# EAGLE design RATT_REV0 (EAGLE 7.7.0)
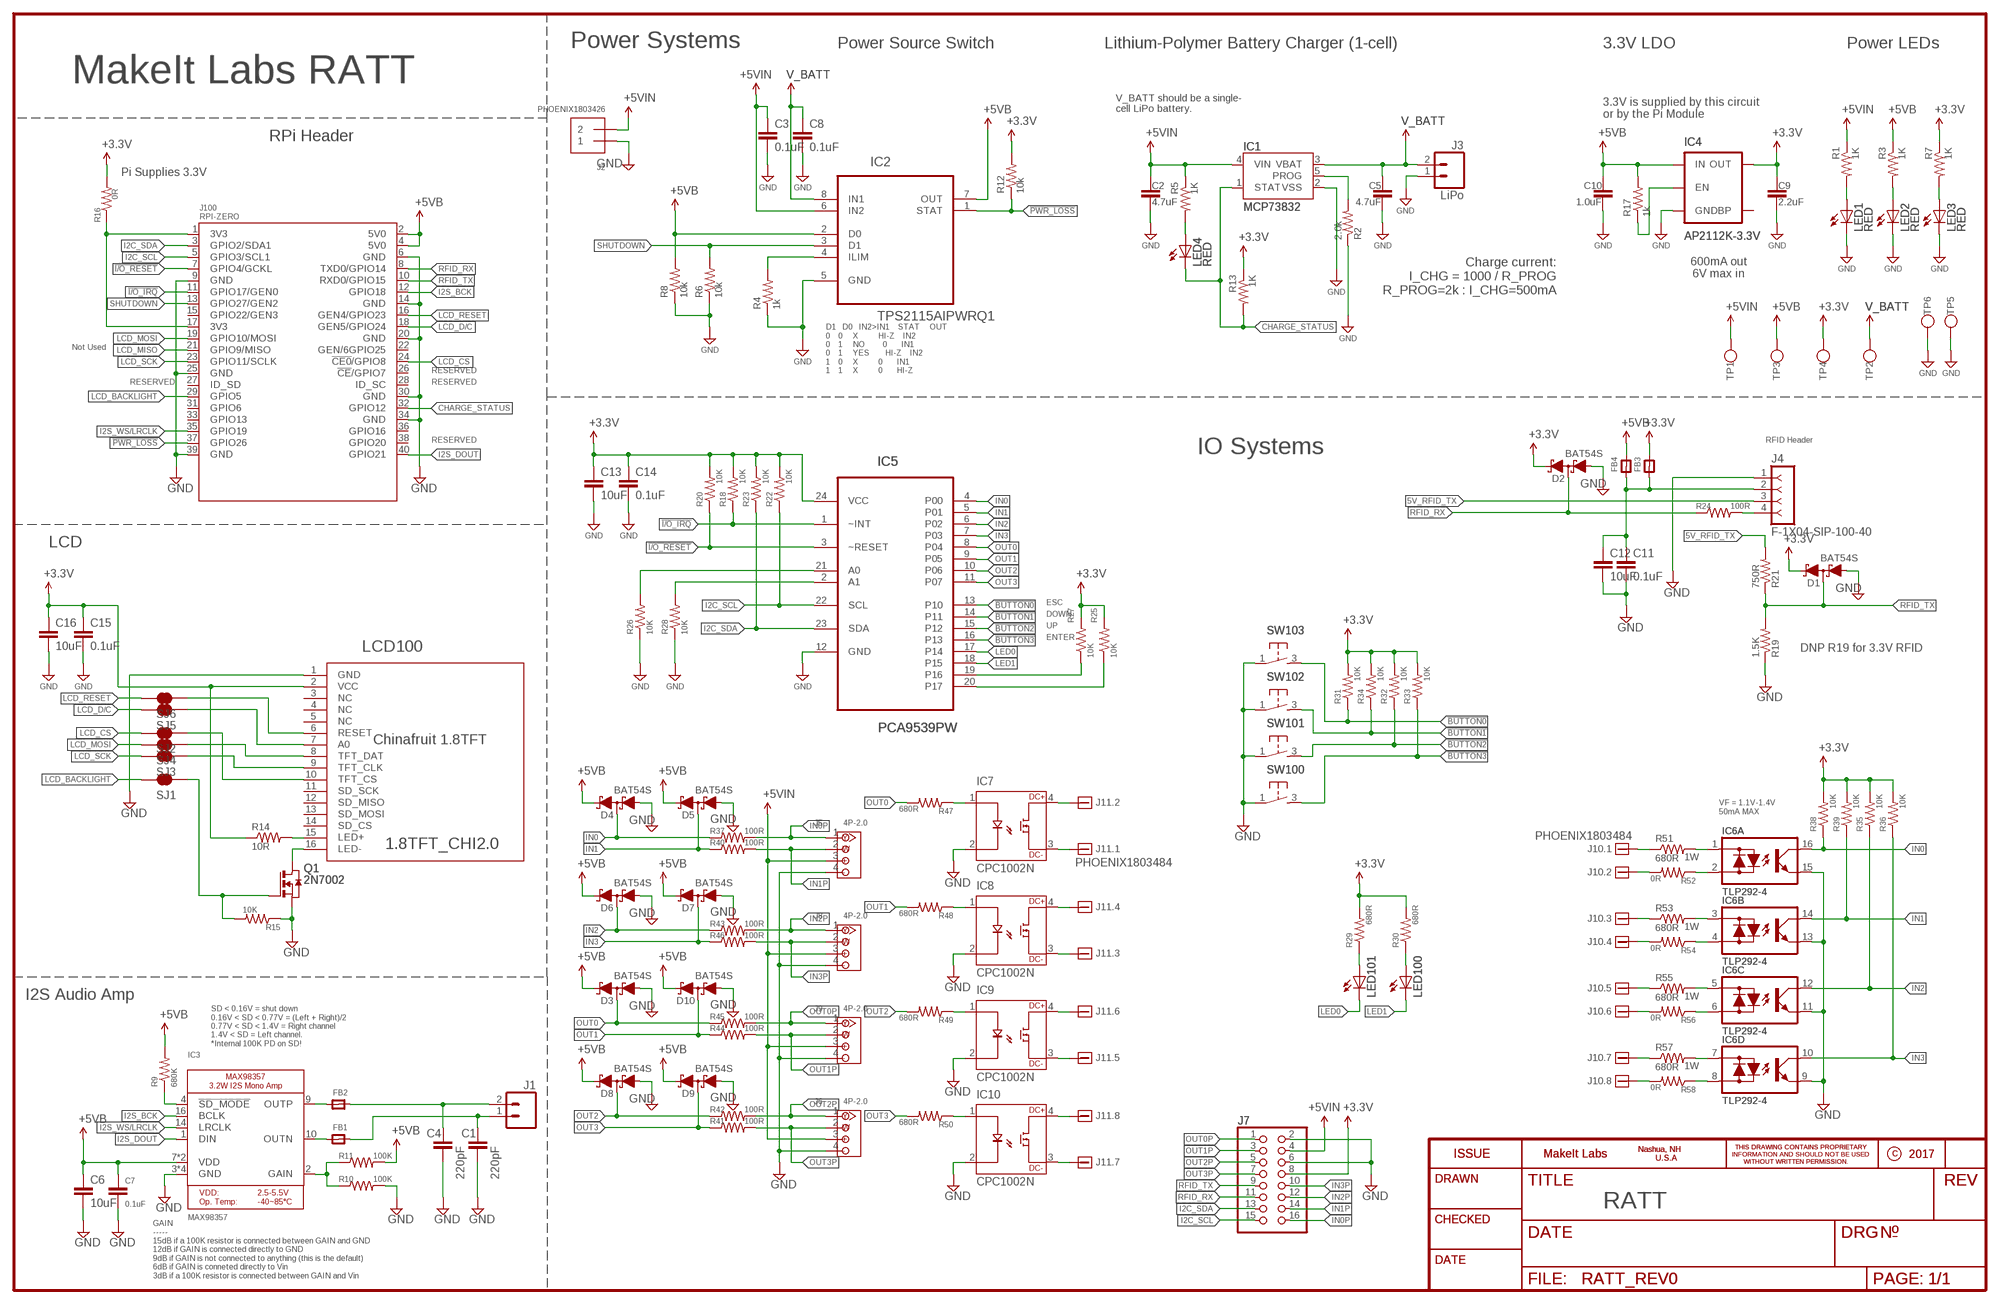
[diagram p0: schematic, sheet 1]

## Parts
C1  220pF  CAP0603  [0603-CAP]
C2  4.7uF  CAP0603  [0603-CAP]
C3  0.1uF  CAP0603  [0603-CAP]
C4  220pF  CAP0603  [0603-CAP]
C5  4.7uF  CAP0603  [0603-CAP]
C6  10uF  CAP0805  [0805-CAP]
C7  0.1uF  CAP0603  [0603-CAP]
C8  0.1uF  CAP0603  [0603-CAP]
C9  2.2uF  CAP0603  [0603-CAP]
C10  1.0uF  CAP0603  [0603-CAP]
C11  0.1uF  CAP0603  [0603-CAP]
C12  10uF  CAP0805  [0805-CAP]
C13  10uF  CAP0805  [0805-CAP]
C14  0.1uF  CAP0603  [0603-CAP]
C15  0.1uF  CAP0603  [0603-CAP]
C16  10uF  CAP0805  [0805-CAP]
D1  BAT54S  [SOT-23]
D2  BAT54S  [SOT-23]
D3  BAT54S  [SOT-23]
D4  BAT54S  [SOT-23]
D5  BAT54S  [SOT-23]
D6  BAT54S  [SOT-23]
D7  BAT54S  [SOT-23]
D8  BAT54S  [SOT-23]
D9  BAT54S  [SOT-23]
D10  BAT54S  [SOT-23]
FB1  FERRITE  [0603]
FB2  FERRITE  [0603]
FB3  FERRITE  [0603]
FB4  FERRITE  [0603]
IC1  MCP73832  MCP73831  [SOT23-5]
IC2  TPS2115AIPWRQ1  [SOP65P640X120-8N]
IC3  MAX98357  AUDIOAMP_MAX98357  [QFN16_3MM]
IC4  AP2112K-3.3V  V_REG_LDOSMD  [SOT23-5]
IC5  PCA9539PW  [SOP65P640X120-24N]
IC6  TLP292-4  [SO-16]
IC7  CPC1002N  [CPC1002N]
IC8  CPC1002N  [CPC1002N]
IC9  CPC1002N  [CPC1002N]
IC10  CPC1002N  [CPC1002N]
J1  M02POLAR  [MOLEX-1X2]
J2  PHOENIX1803426  [1803426]
J3  LiPo  M02JST-PTH-2  [JST-2-PTH]
J4  F-1X04-SIP-100-40  [SIP-100-04-40]
J5  4P-2.0  GROVE-CONNECTOR-TH-VERT  [HW4-2.0]
J6  4P-2.0  GROVE-CONNECTOR-TH-VERT  [HW4-2.0]
J7  PINHD-2X8SHROUD  [2X08_SHROUD]
J8  4P-2.0  GROVE-CONNECTOR-TH-VERT  [HW4-2.0]
J9  4P-2.0  GROVE-CONNECTOR-TH-VERT  [HW4-2.0]
J10  PHOENIX1803484  [1803484]
J11  PHOENIX1803484  [1803484]
J100  RPI-ZERO  [RASPBERRYPI_BASTELSTUBE_V13_RASPI_BOARD_B+_FULL]
LCD100  1.8TFT_CHI2.0  [1.8TFT_CHI_2.0]
LED1  RED  LED-RED0603  [LED-0603]
LED2  RED  LED-RED0603  [LED-0603]
LED3  RED  LED-RED0603  [LED-0603]
LED4  RED  LED-RED0603  [LED-0603]
LED100  LED5MM  [LED5MM]
LED101  LED5MM  [LED5MM]
Q1  2N7002  NMOSSOT23  [SOT-23]
R1  1K  RESISTOR0603  [0603-RES]
R2  2.0k  RESISTOR0603  [0603-RES]
R3  1K  RESISTOR0603  [0603-RES]
R4  1k  RESISTOR0603  [0603-RES]
R5  1K  RESISTOR0603  [0603-RES]
R6  10k  RESISTOR0603  [0603-RES]
R7  1K  RESISTOR0603  [0603-RES]
R8  10k  RESISTOR0603  [0603-RES]
R9  680K  RESISTOR0603  [0603-RES]
R10  100K  RESISTOR0603  [0603-RES]
R11  100K  RESISTOR0603  [0603-RES]
R12  10k  RESISTOR0603  [0603-RES]
R13  1K  RESISTOR0603  [0603-RES]
R14  10R  RESISTOR1206  [1206-RES]
R15  10K  RESISTOR0603  [0603-RES]
R16  0R  RESISTOR0603  [0603-RES]
R17  1k  RESISTOR0603  [0603-RES]
R18  10K  RESISTOR0603  [0603-RES]
R19  1.5K  RESISTOR0603  [0603-RES]
R20  10K  RESISTOR0603  [0603-RES]
R21  750R  RESISTOR0603  [0603-RES]
R22  10K  RESISTOR0603  [0603-RES]
R23  10K  RESISTOR0603  [0603-RES]
R24  100R  RESISTOR0603  [0603-RES]
R25  10K  RESISTOR0603  [0603-RES]
R26  10K  RESISTOR0603  [0603-RES]
R27  10K  RESISTOR0603  [0603-RES]
R28  10K  RESISTOR0603  [0603-RES]
R29  680R  RESISTOR0603  [0603-RES]
R30  680R  RESISTOR0603  [0603-RES]
R31  10K  RESISTOR0603  [0603-RES]
R32  10K  RESISTOR0603  [0603-RES]
R33  10K  RESISTOR0603  [0603-RES]
R34  10K  RESISTOR0603  [0603-RES]
R35  10K  RESISTOR0603  [0603-RES]
R36  10K  RESISTOR0603  [0603-RES]
R37  100R  RESISTOR0603  [0603-RES]
R38  10K  RESISTOR0603  [0603-RES]
R39  10K  RESISTOR0603  [0603-RES]
R40  100R  RESISTOR0603  [0603-RES]
R41  100R  RESISTOR0603  [0603-RES]
R42  100R  RESISTOR0603  [0603-RES]
R43  100R  RESISTOR0603  [0603-RES]
R44  100R  RESISTOR0603  [0603-RES]
R45  100R  RESISTOR0603  [0603-RES]
R46  100R  RESISTOR0603  [0603-RES]
R47  680R  RESISTOR0603  [0603-RES]
R48  680R  RESISTOR0603  [0603-RES]
R49  680R  RESISTOR0603  [0603-RES]
R50  680R  RESISTOR0603  [0603-RES]
R51  680R  RESISTOR2512  [2512-RES]
R52  0R  RESISTOR0603  [0603-RES]
R53  680R  RESISTOR2512  [2512-RES]
R54  0R  RESISTOR0603  [0603-RES]
R55  680R  RESISTOR2512  [2512-RES]
R56  0R  RESISTOR0603  [0603-RES]
R57  680R  RESISTOR2512  [2512-RES]
R58  0R  RESISTOR0603  [0603-RES]
SJ1  JUMPER-PAD-2-NC_BY_TRACE  SOLDERJUMPER_CLOSED10MIL  [SOLDERJUMPER_10MIL]
SJ2  JUMPER-PAD-2-NC_BY_TRACE  SOLDERJUMPER_CLOSED10MIL  [SOLDERJUMPER_10MIL]
SJ3  JUMPER-PAD-2-NC_BY_TRACE  SOLDERJUMPER_CLOSED10MIL  [SOLDERJUMPER_10MIL]
SJ4  JUMPER-PAD-2-NC_BY_TRACE  SOLDERJUMPER_CLOSED10MIL  [SOLDERJUMPER_10MIL]
SJ5  JUMPER-PAD-2-NC_BY_TRACE  SOLDERJUMPER_CLOSED10MIL  [SOLDERJUMPER_10MIL]
SJ6  JUMPER-PAD-2-NC_BY_TRACE  SOLDERJUMPER_CLOSED10MIL  [SOLDERJUMPER_10MIL]
SW100  ESWITCH_320  [ESWITCH320]
SW101  ESWITCH_320  [ESWITCH320]
SW102  ESWITCH_320  [ESWITCH320]
SW103  ESWITCH_320  [ESWITCH320]
TP1  5VIN  RCW-0C  [1206-RCW]
TP2  BATT  RCW-0C  [1206-RCW]
TP3  5VB  RCW-0C  [1206-RCW]
TP4  3.3V  RCW-0C  [1206-RCW]
TP5  GND  RCW-0C  [1206-RCW]
TP6  GND  RCW-0C  [1206-RCW]

## Nets
3V3: J100.1(3V3) J100.17(3V3) R16.1
5V_RFID_TX: J4.3 R21.2
!BUTTON0: IC5.13(P10) R31.1 SW103.3
!BUTTON1: IC5.14(P11) R34.1 SW102.3
!BUTTON2: IC5.15(P12) R32.1 SW101.3
!BUTTON3: IC5.16(P13) R33.1 SW100.3
!I/O_IRQ: IC5.1(~INT) J100.11(GPIO17/GEN0) R18.1
!I/O_RESET: IC5.3(~RESET) J100.7(GPIO4/GCKL) R20.1
!PWR_LOSS: IC2.1(STAT) J100.37(GPIO26) R12.1
+3.3V: C9.1 C13.1 C14.1 C15.1 C16.1 D1.2(C2) D2.2(C2) FB3.2 IC4.5(OUT) IC5.24(VCC) J7.8 LCD100.2(VCC) R7.1 R12.2 R13.1 R14.1 R16.2 R18.2 R20.2 R22.2 R23.2 R25.2 R27.2 R29.2 R30.2 R31.2 R32.2 R33.2 R34.2 R35.2 R36.2 R38.2 R39.2 TP4.1(TP)
+5VB: C6.1 C7.1 C10.1 D3.2(C2) D4.2(C2) D5.2(C2) D6.2(C2) D7.2(C2) D8.2(C2) D9.2(C2) D10.2(C2) FB4.2 IC2.2(D0) IC2.7(OUT) IC3.7(VDD) IC3.8(VDD) IC4.1(IN) J100.2(5V0) J100.4(5V0) R3.1 R8.2 R9.2 R11.2 R17.2 TP3.1(TP)
+5VIN: C2.1 C3.1 IC1.4(VIN) IC2.6(IN2) J2.2 J5.3 J6.3 J7.4 J8.3 J9.3 R1.1 R5.1 TP1.1(TP)
CHARGE_STATUS: IC1.1(STAT) J100.32(GPIO12) LED4.C R13.2
GND: C1.2 C2.2 C3.2 C4.2 C5.2 C6.2 C7.2 C8.2 C9.2 C10.2 C11.2 C12.2 C13.2 C14.2 C15.2 C16.2 D1.1(A1) D2.1(A1) D3.1(A1) D4.1(A1) D5.1(A1) D6.1(A1) D7.1(A1) D8.1(A1) D9.1(A1) D10.1(A1) IC1.2(VSS) IC2.5(GND) IC3.3(GND) IC3.11(GND) IC3.15(GND) IC3.THERMAL(GND) IC4.2(GND) IC5.12(GND) IC6.9(D:E) IC6.11(C:E) IC6.13(B:E) IC6.15(A:E) IC7.2(CATHODE) IC8.2(CATHODE) IC9.2(CATHODE) IC10.2(CATHODE) J2.1 J3.1 J4.1 J5.4 J6.4 J7.2 J7.6 J8.4 J9.4 J100.6(GND) J100.9(GND) J100.14(GND) J100.20(GND) J100.25(GND) J100.30(GND) J100.34(GND) J100.39(GND) LCD100.1(GND) LED1.C LED2.C LED3.C Q1.2(S) R2.1 R4.1 R6.1 R8.1 R10.2 R15.1 R19.1 R26.1 R28.1 SW100.1 SW101.1 SW102.1 SW103.1 TP5.1(TP) TP6.1(TP)
I2C_SCL: IC5.22(SCL) J7.15 J100.5(GPIO3/SCL1) R22.1
I2C_SDA: IC5.23(SDA) J7.13 J100.3(GPIO2/SDA1) R23.1
I2S_BCK: IC3.16(BCLK) J100.12(GPIO18)
I2S_DOUT: IC3.1(DIN) J100.40(GPIO21)
I2S_WS/LRCLK: IC3.14(LRCLK) J100.35(GPIO19)
IN0: D4.3(C1A2) IC5.4(P00) IC6.16(A:C) R37.1 R38.1
IN0P: J5.1 J7.16 R37.2
IN1: D5.3(C1A2) IC5.5(P01) IC6.14(B:C) R39.1 R40.1
IN1P: J5.2 J7.14 R40.2
IN2: D6.3(C1A2) IC5.6(P02) IC6.12(C:C) R35.1 R43.1
IN2P: J7.12 J8.1 R43.2
IN3: D7.3(C1A2) IC5.7(P03) IC6.10(D:C) R36.1 R46.1
IN3P: J7.10 J8.2 R46.2
LCD_BACKLIGHT: J100.29(GPIO5) SJ1.2
LCD_CS: J100.24(!CE0!/GPIO8) SJ2.2
LCD_D/C: J100.18(GEN5/GPIO24) SJ5.2
LCD_MISO: J100.21(GPIO9/MISO)
LCD_MOSI: J100.19(GPIO10/MOSI) SJ4.2
LCD_RESET: J100.16(GEN4/GPIO23) SJ6.2
LCD_SCK: J100.23(GPIO11/SCLK) SJ3.2
LED0: IC5.17(P14) LED101.K(C)
LED1: IC5.18(P15) LED100.K(C)
N$1: IC3.2(GAIN) R10.1 R11.1
N$2: FB2.1 IC3.9(OUTP)
N$4: FB1.1 IC3.10(OUTN)
N$5: IC3.4(!SD_MODE) R9.1
N$6: C1.1 FB1.2 J1.1
N$7: C4.1 FB2.2 J1.2
N$8: IC5.20(P17) R25.1
N$9: LCD100.15(LED+) R14.2
N$10: J4.4 R24.2
N$11: LED3.A R7.2
N$12: LED2.A R3.2
N$13: IC5.19(P16) R27.1
N$14: IC1.5(PROG) R2.2
N$15: IC6.2(A:AC2) R52.1
N$17: LED4.A R5.2
N$18: IC4.3(EN) R17.1
N$19: IC6.1(A:AC1) R51.2
N$20: IC6.8(D:AC2) R58.1
N$21: IC5.21(A0) R26.2
N$22: IC5.2(A1) R28.2
N$23: IC6.7(D:AC1) R57.2
N$24: IC6.6(C:AC2) R56.1
N$25: IC6.5(C:AC1) R55.2
N$27: LCD100.6(RESET) SJ6.1
N$28: LCD100.7(A0) SJ5.1
N$29: LCD100.10(TFT_CS) SJ2.1
N$30: LCD100.8(TFT_DAT) SJ4.1
N$31: LCD100.9(TFT_CLK) SJ3.1
N$32: IC7.3(DC-) J11.1
N$33: Q1.3(G) R15.2 SJ1.1
N$34: LCD100.16(LED-) Q1.1(D)
N$36: IC6.4(B:AC2) R54.1
N$37: IC2.4(ILIM) R4.2
N$39: IC6.3(B:AC1) R53.2
N$40: J10.4 R54.2
N$41: J10.3 R53.1
N$42: J10.2 R52.2
N$43: J10.1 R51.1
N$44: J10.5 R55.1
N$45: J10.6 R56.2
N$46: J10.7 R57.1
N$47: J10.8 R58.2
N$48: LED101.A R29.1
N$49: LED100.A R30.1
N$50: LED1.A R1.2
N$51: C11.1 C12.1 FB3.1 FB4.1 J4.2
N$58: IC7.1(ANODE) R47.1
N$59: IC7.4(DC+) J11.2
N$60: IC10.3(DC-) J11.7
N$61: IC8.1(ANODE) R48.1
N$62: IC10.4(DC+) J11.8
N$63: IC9.3(DC-) J11.5
N$64: IC9.4(DC+) J11.6
N$65: IC8.3(DC-) J11.3
N$66: IC8.4(DC+) J11.4
N$68: IC9.1(ANODE) R49.1
N$69: IC10.1(ANODE) R50.1
OUT0: D3.3(C1A2) IC5.8(P04) R45.1 R47.2
OUT0P: J7.1 J9.1 R45.2
OUT1: D10.3(C1A2) IC5.9(P05) R44.1 R48.2
OUT1P: J7.3 J9.2 R44.2
OUT2: D8.3(C1A2) IC5.10(P06) R42.1 R49.2
OUT2P: J6.1 J7.5 R42.2
OUT3: D9.3(C1A2) IC5.11(P07) R41.1 R50.2
OUT3P: J6.2 J7.7 R41.2
RFID_RX: D2.3(C1A2) J7.11 J100.8(TXD0/GPIO14) R24.1
RFID_TX: D1.3(C1A2) J7.9 J100.10(RXD0/GPIO15) R19.2 R21.1
SHUTDOWN: IC2.3(D1) J100.13(GPIO27/GEN2) R6.2
V_BATT: C5.1 C8.1 IC1.3(VBAT) IC2.8(IN1) J3.2 TP2.1(TP)
Unconnected: IC4.4(BP) J100.15(GPIO22/GEN3) J100.22(GEN/6GPIO25) J100.26(!CE!/GPIO7) J100.27(ID_SD) J100.28(ID_SC) J100.31(GPIO6) J100.33(GPIO13) J100.36(GPIO16) J100.38(GPIO20) LCD100.3(NC) LCD100.4(NC) LCD100.5(NC) LCD100.11(SD_SCK) LCD100.12(SD_MISO) LCD100.13(SD_MOSI) LCD100.14(SD_CS)

## Notes on the sheet
- Power Systems | Power Source Switch | Lithium-Polymer Battery Charger (1-cell) | 3.3V LDO | Power LEDs
- MakeIt Labs RATT
- V_BATT should be a single-
  cell LiPo battery.
- 3.3V is supplied by this circuit
  or by the Pi Module
- RPi Header
- Pi Supplies 3.3V
- Charge current:
  I_CHG = 1000 / R_PROG
  R_PROG=2k : I_CHG=500mA
- 600mA out
  6V max in
- Not Used
- RESERVED
- D1   D0   IN2>IN1    STAT     OUT
  0    0     X          HI-Z    IN2
  0    1     NO         0       IN1
  0    1     YES        HI-Z    IN2
  1    0     X          0       IN1
  1    1     X          0       HI-Z
- RESERVED | RESERVED
- RESERVED | RFID Header
- IO Systems
- LCD
- ESC
- DOWN
- UP
- ENTER
- DNP R19 for 3.3V RFID
- VF = 1.1V-1.4V
  50mA MAX
- I2S Audio Amp
- SD < 0.16V = shut down 
  0.16V < SD < 0.77V = (Left + Right)/2 
  0.77V < SD < 1.4V = Right channel
  1.4V < SD = Left channel.
  *Internal 100K PD on SD!
- RATT
- GAIN
  -----
  15dB if a 100K resistor is connected between GAIN and GND 
  12dB if GAIN is connected directly to GND 
  9dB if GAIN is not connected to anything (this is the default)
  6dB if GAIN is conneted directly to Vin 
  3dB if a 100K resistor is connected between GAIN and Vin

## Library data of the parts
C1-C6 C8-C16 = MakeItLabs:CAP: Capacitor Standard ceramic capacitor Footprints per IPC-7351 Density Level B
C7 = MakeItLabs:CAP: Capacitor Standard ceramic capacitor Footprints per IPC-7351 Density Level B; RATING: X7R; TOL: 10%; V: 16V
D1-D10 = MakeItLabs:BAT54S: Schottky Diodes Dual Diodes, Cathode to Anode
FB1-FB4 = MakeItLabs:FERRITE: Ferrite Bead 0603 MMZ1608B121C - 120 Ohm @ 100MHz, 600mA, 0.15 Ohm DC Resistance - Digikey: 445-2164-1-ND BK1608HW121-T - 120 Ohm, 600mA Ferrite Chip - Digikey: 587-1876-2-ND 0805 HZ0805B272R-10 - 2.7K Ohm @ 100MHz, 200mA, 0.8 Ohm DC Resistance - Digikey: 240-2504-1-ND (see also Murata BLM21BD272SN1L) MMZ2012Y152B - 1.5K Ohm @ 100MHz, 500mA, 0.4 Ohm DC Resistance - Digikey: 445-1560-1-ND - Mainly for high frequency (80-400MHz) MMZ2012R102A - 1K Ohm @ 100MHz, 500mA, 0.3 Ohm DC Resistance - Digikey: 445-1555-2-ND - More general purpose (10-200MHz)
IC1 = MakeItLabs:MCP73831: Miniature single cell, fully integrated Li-Ion, Li-polymer charge management controller http://ww1.microchip.com/downloads/en/DeviceDoc/20001984g.pdf IC-09995; PROD_ID: IC-09995
IC2 = MakeItLabs:TPS2115AIPWRQ1: AUTO-SWITCHING POWER MULTIPLEXER; MPN: TPS2115AIPWRQ1; OC_FARNELL: -; OC_NEWARK: 52P6807; PACKAGE: TSSOP-8; SUPPLIER: Texas Instruments
IC3 = MakeItLabs:AUDIOAMP_MAX98357: MAX98357 - 3.2W I2S Mono Audio Amp
IC4 = MakeItLabs:V_REG_LDO: Voltage Regulator LDO Standard 150mA LDO voltage regulator in SOT-23 layout. Micrel part MIC5205. BP (by-pass) pin is used to lower output noise with 470pF cap.; PROD_ID: VREG-12457
IC5 = MakeItLabs:PCA9539PW: REMOTE 16-BIT I2C AND SMBus LOW-POWER I/O EXPANDER WITH INTERRUPT OUTPUT, RESET, AND CONFIGURATION REGISTERS; MPN: PCA9539PW; OC_FARNELL: 1470505; OC_NEWARK: 63K6061; PACKAGE: TSSOP-24; SUPPLIER: Texas Instruments
IC6 = MakeItLabs:TLP292-4: Optoisolator Transistor Output 3750Vrms 4 Channel 16-SO
IC7-IC10 = MakeItLabs:CPC1002N
J1 J3 = MakeItLabs:M02: Header 2 Standard 2-pin 0.1" header. Use with straight break away headers (SKU : PRT-00116), right angle break away headers (PRT-00553), swiss pins (PRT-00743), machine pins (PRT-00117), and female headers (PRT-00115). Molex polarized connector foot print use with SKU : PRT-08233 with associated crimp pins and housings.
J2 = MakeItLabs:PHOENIX1803426
J4 = MakeItLabs:F-1X04-: FEMALE HEADER
J5 J6 J8 J9 = MakeItLabs:GROVE-CONNECTOR-TH: 320110033
J7 = MakeItLabs:PINHD-2X8: PIN HEADER
J10 J11 = MakeItLabs:PHOENIX1803484: 8 A 60 V Pitch: 3.81 mm Position: 8 Source: https://www.phoenixcontact.com/us/products/1803484
J100 = MakeItLabs:RPI-ZERO
LCD100 = MakeItLabs:1.8TFT_CHI
LED1-LED4 = MakeItLabs:LED-RED: Assorted Red LEDs LilyPad 1206- DIO-09912 1206- DIO-00809 0603- DIO-00819; PROD_ID: DIO-09912
LED100 LED101 = MakeItLabs:LED: LEDs Standard schematic elements and footprints for 5mm, 3mm, 1206, and 0603 sized LEDs. 5mm - Spark Fun Electronics SKU : COM-00529 (and others)
Q1 = MakeItLabs:NMOSSOT23: MOS FET; OC_FARNELL: unknown; OC_NEWARK: unknown
R1-R50 R52 R54 R56 R58 = MakeItLabs:RESISTOR: Resistor Basic schematic elements and footprints for 0603, 1206, and PTH resistors.
R51 R53 R55 R57 = MakeItLabs:RESISTOR: Resistor Basic schematic elements and footprints for 0603, 1206, and PTH resistors.; P: 1W
SJ1-SJ6 = MakeItLabs:SOLDERJUMPER_CLOSED: Solder Jumper - Closed These solder jumpers are closed by default CLOSEDWIRE - 10 mil trace between pads that can be cut and resoldered later CLOSEDPERM - 63 mil trace between pads for a permanent connection (used to 'bridge' two signals, a shameless hack for Eagle). Can double as a test point as well (no cream layer)
SW100-SW103 = MakeItLabs:ESWITCH_320
TP1-TP6 = MakeItLabs:RCW-0C: SMD Circuit Probe Pad Test Pad 1206 Size

## Board
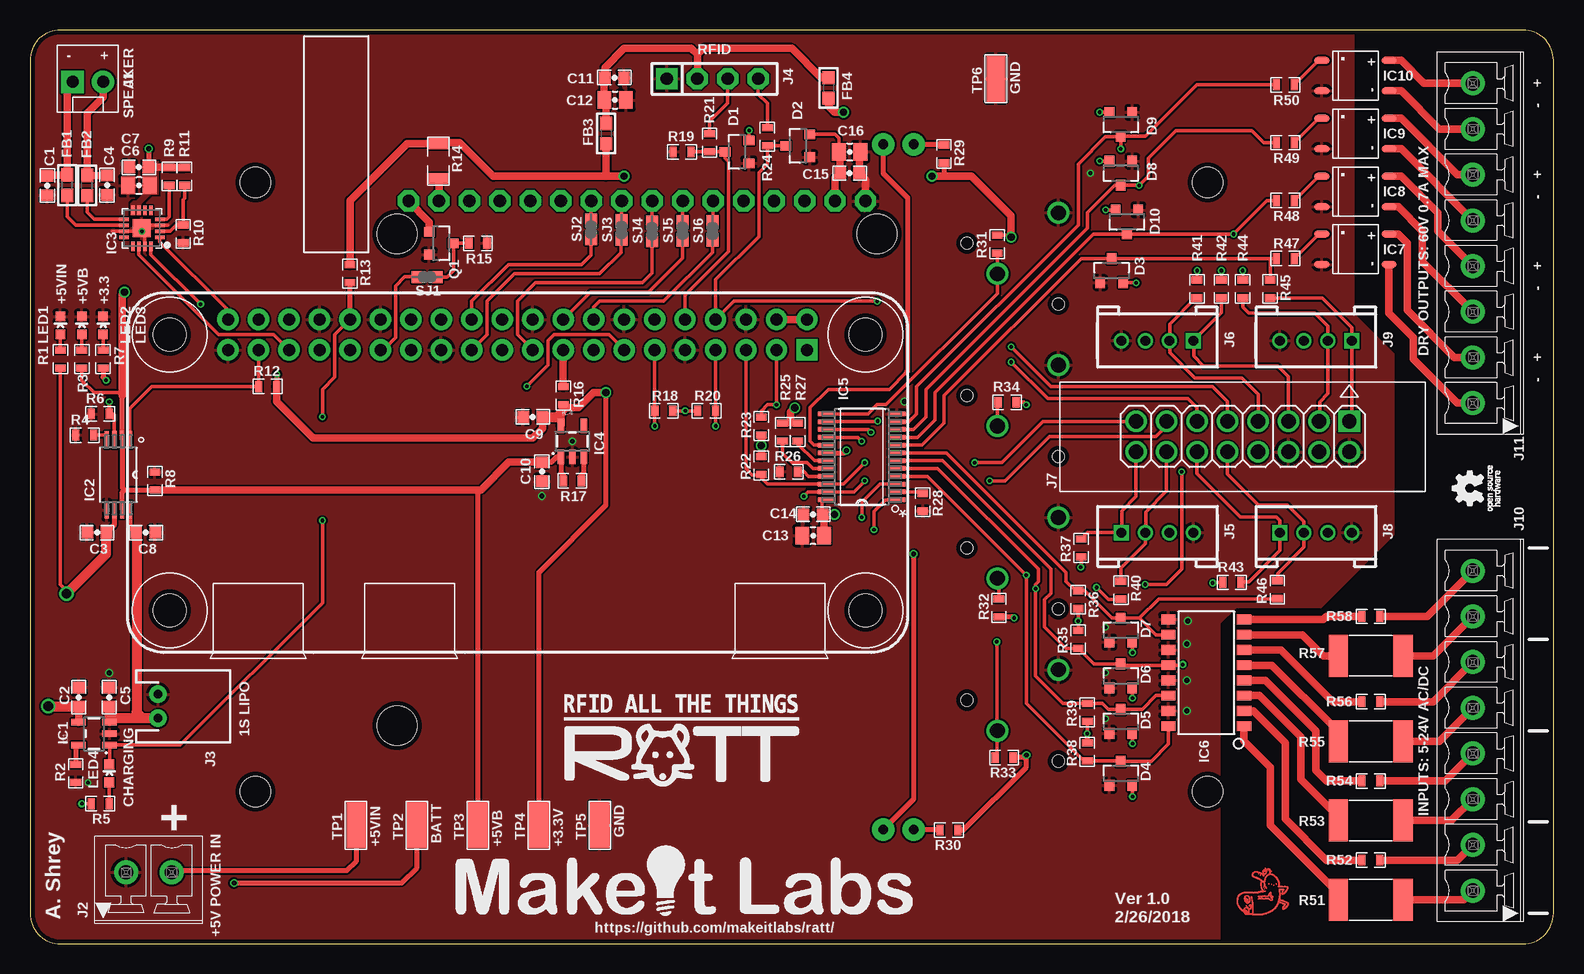
[diagram p1: board, top side]
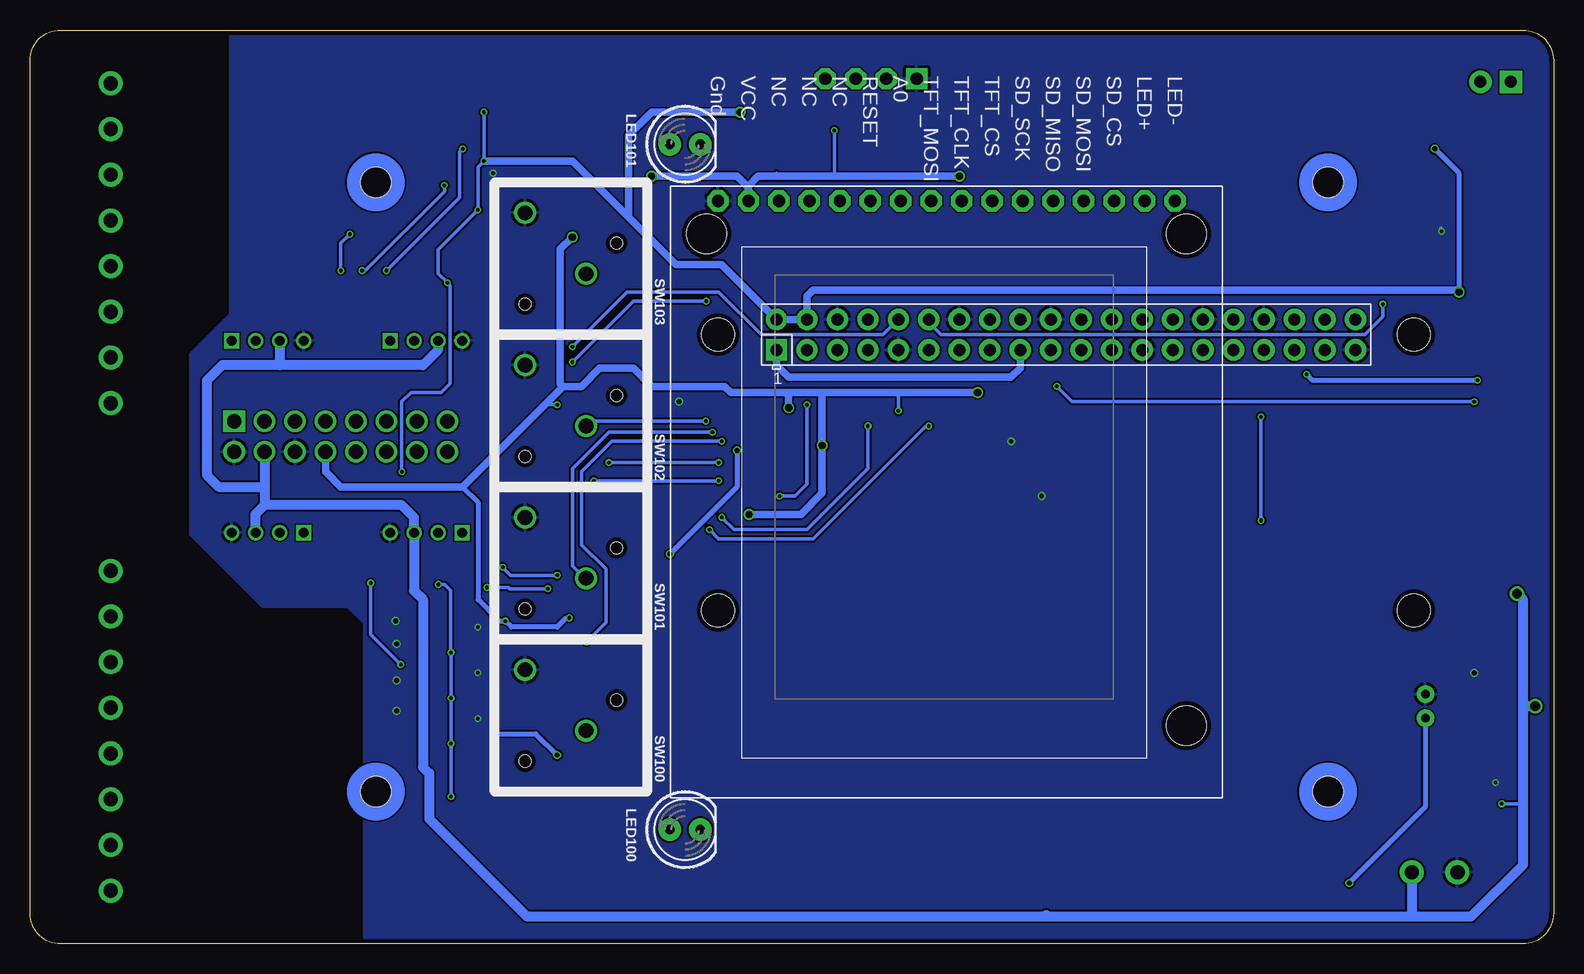
[diagram p2: board, bottom side, seen from below]

Size 127 x 76.2 mm. Coordinates in mm from the lower left corner, seen from the top.
Outline: 0,2.54 arc90 2.54,0 124.46,0 arc90 127,2.54 127,73.66 arc90 124.46,76.2 2.54,76.2 arc90 0,73.66 0,2.54
Copper layers (1*16): Top 0.035559375mm / dielectric 1.6mm / Bottom 0.035559375mm
Design rules "oshpark-2layer *": minimum track width 6mil, minimum drill 10mil, track to track 6mil, track to pad 6mil, pad to pad 6mil, via to via 6mil, smd to smd 6mil, copper to edge 15mil, drill to drill 6mil, minimum pad ring 5mil, minimum via ring 5mil, stop-mask expansion 2.5mil, vias tented up to drill 0mil, thermal gap 10mil
Holes 2.54 mm at 18.8,63.5 18.8,12.7 98.17,63.5 98.17,12.7
tKeepout: area 15,59.7 to 22.6,67.3; area 15,8.9 to 22.6,16.5; area 94.4,8.9 to 102,16.5; area 94.4,59.7 to 102,67.3

### Footprints (pad centres in the part's own frame; a part is rotated, then mirrored left to right if it is on the bottom)
0603-CAP = smd 0.95 x 1: 1 -0.8,0; 2 0.8,0
0805-CAP = smd 1.15 x 1.45: 1 -0.9,0; 2 0.9,0
SOT-23 = smd 0.8 x 0.9: 1 -0.95,-1; 2 0.95,-1; 3 0,1
0603 = smd 1.1 x 1: 1 -0.85,0; 2 0.85,0
SOT23-5 = smd 0.55 x 1.2: 1 -0.95,-1.3; 2 0,-1.3; 3 0.95,-1.3; 4 0.95,1.3; 5 -0.95,1.3
SOP65P640X120-8N = smd 1.473 x 0.356: 1 -2.921,0.965; 2 -2.921,0.33; 3 -2.921,-0.33; 4 -2.921,-0.965; 5 2.921,-0.965; 6 2.921,-0.33; 7 2.921,0.33; 8 2.921,0.965
QFN16_3MM = smd 0.8 x 0.28: 1 -1.5,0.75; 2 -1.5,0.25; 3 -1.5,-0.25; 4 -1.5,-0.75; 9 1.5,-0.75; 10 1.5,-0.25; 11 1.5,0.25; 12 1.5,0.75 | smd 0.28 x 0.8: 5 -0.75,-1.5; 6 -0.25,-1.5; 7 0.25,-1.5; 8 0.75,-1.5; 13 0.75,1.5; 14 0.25,1.5; 15 -0.25,1.5; 16 -0.75,1.5 | smd 1.5 x 1.5: THERMAL 0,0
SOP65P640X120-24N = smd 1.473 x 0.356: 1 -2.921,3.581; 2 -2.921,2.921; 3 -2.921,2.286; 4 -2.921,1.626; 5 -2.921,0.965; 6 -2.921,0.33; 7 -2.921,-0.33; 8 -2.921,-0.965; 9 -2.921,-1.626; 10 -2.921,-2.286; 11 -2.921,-2.921; 12 -2.921,-3.581; 13 2.921,-3.581; 14 2.921,-2.921; 15 2.921,-2.286; 16 2.921,-1.626; 17 2.921,-0.965; 18 2.921,-0.33; 19 2.921,0.33; 20 2.921,0.965; 21 2.921,1.626; 22 2.921,2.286; 23 2.921,2.921; 24 2.921,3.581
SO-16 = smd 0.8 x 1.2: 1 -4.445,-3.15; 2 -3.175,-3.15; 3 -1.905,-3.15; 4 -0.635,-3.15; 5 0.635,-3.15; 6 1.905,-3.15; 7 3.175,-3.15; 8 4.445,-3.15; 9 4.445,3.15; 10 3.175,3.15; 11 1.905,3.15; 12 0.635,3.15; 13 -0.635,3.15; 14 -1.905,3.15; 15 -3.175,3.15; 16 -4.445,3.15
CPC1002N = smd 0.6 x 1.3: 1 -1.27,-2.8; 2 1.27,-2.8; 3 1.27,2.8; 4 -1.27,2.8
MOLEX-1X2 = drill 1.016 pad 1.88 square: 1 0,0 | drill 1.016 pad 1.88: 2 2.54,0
1803426 = drill 1.2 pad 2: 1 -1.905,0.635; 2 1.905,0.635
JST-2-PTH = drill 0.7 pad 1.448: 1 -1,0; 2 1,0
SIP-100-04-40 = drill 1.016 pad 1.778 square: 1 -3.81,0 | drill 1.016 pad 1.778 octagon: 2 -1.27,0; 3 1.27,0; 4 3.81,0
HW4-2.0 = drill 0.8 pad 1.27 square: 1 -3,0 | drill 0.8 pad 1.27: 2 -1,0; 3 1,0; 4 3,0
2X08_SHROUD = drill 1.2 square: 1 -8.89,-1.27 | drill 1.2: 2 -8.89,1.27; 3 -6.35,-1.27; 4 -6.35,1.27; 5 -3.81,-1.27; 6 -3.81,1.27; 7 -1.27,-1.27; 8 -1.27,1.27; 9 1.27,-1.27; 10 1.27,1.27; 11 3.81,-1.27; 12 3.81,1.27; 13 6.35,-1.27; 14 6.35,1.27; 15 8.89,-1.27; 16 8.89,1.27
1803484 = drill 1.2 pad 2: 1 -13.335,0.635; 2 -9.525,0.635; 3 -5.715,0.635; 4 -1.905,0.635; 5 1.905,0.635; 6 5.715,0.635; 7 9.525,0.635; 8 13.335,0.635
RASPBERRYPI_BASTELSTUBE_V13_RASPI_BOARD_B+_FULL = drill 1 pad 1.778 square: 1 -24.13,-1.27 | drill 1 pad 1.778: 2 -24.13,1.27; 3 -21.59,-1.27; 4 -21.59,1.27; 5 -19.05,-1.27; 6 -19.05,1.27; 7 -16.51,-1.27; 8 -16.51,1.27; 9 -13.97,-1.27; 10 -13.97,1.27; 11 -11.43,-1.27; 12 -11.43,1.27; 13 -8.89,-1.27; 14 -8.89,1.27; 15 -6.35,-1.27; 16 -6.35,1.27; 17 -3.81,-1.27; 18 -3.81,1.27; 19 -1.27,-1.27; 20 -1.27,1.27; 21 1.27,-1.27; 22 1.27,1.27; 23 3.81,-1.27; 24 3.81,1.27; 25 6.35,-1.27; 26 6.35,1.27; 27 8.89,-1.27; 28 8.89,1.27; 29 11.43,-1.27; 30 11.43,1.27; 31 13.97,-1.27; 32 13.97,1.27; 33 16.51,-1.27; 34 16.51,1.27; 35 19.05,-1.27; 36 19.05,1.27; 37 21.59,-1.27; 38 21.59,1.27; 39 24.13,-1.27; 40 24.13,1.27 | hole 2.75: -29,-23; -29,0; 29,-23; 29,0
1.8TFT_CHI_2.0 = drill 1.016 pad 1.778 octagon: 1 -23.85,-18.85; 2 -23.85,-16.31; 3 -23.85,-13.77; 4 -23.85,-11.23; 5 -23.85,-8.69; 6 -23.85,-6.15; 7 -23.85,-3.61; 8 -23.85,-1.07; 9 -23.85,1.47; 10 -23.85,4.01; 11 -23.85,6.55; 12 -23.85,9.09; 13 -23.85,11.63; 14 -23.85,14.17; 15 -23.85,16.71; 16 -23.85,19.25 | hole 3.3: 19.9,20.2; -21.1,-19.8; -21.1,20.2
LED-0603 = smd 0.8 x 0.8: A 0,-0.75; C 0,0.75
LED5MM = drill 0.813 pad 1.88: A -1.27,0; K 1.27,0
0603-RES = smd 0.6 x 0.9: 1 -0.75,0; 2 0.75,0
1206-RES = smd 0.9 x 1.6: 1 -1.45,0; 2 1.45,0
2512-RES = smd 1.6 x 3.5: 1 -2.7,0; 2 2.7,0
SOLDERJUMPER_10MIL = smd 1.1 x 1: 1 -0.762,0; 2 0.762,0 | smd 0.635 x 0.254: WIRE 0,0
ESWITCH320 = drill 1.22: 1 -3.81,3.81; 3 1.27,-1.27 | hole 1: -3.81,-3.81; 3.81,1.27
1206-RCW = smd 3.8 x 1.6: 1 0,0

### Placement (x,y rotation side)
C1  1.46,63.23 270 top
C2  4.06,20.57 90 top
C3  5.59,34.29 180 top
C4  6.42,63.26 270 top
C5  6.6,20.57 90 top
C6  9.08,63.23 180 top
C7  9.08,64.75 180 top
C8  9.65,34.29 0 top
C9  41.91,43.94 180 top
C10  42.67,39.37 270 top
C11  48.72,72.24 0 top
C12  48.77,70.36 0 top
C13  65.28,34.04 180 top
C14  65.28,35.81 180 top
C15  68.33,64.26 0 top
C16  68.33,66.04 0 top
D1  58.93,66.04 90 top
D2  64.01,66.55 90 top
D3  90.17,56.13 0 top
D4  90.93,14.22 0 top
D5  90.93,18.54 0 top
D6  90.93,22.35 0 top
D7  90.93,26.16 0 top
D8  90.93,64.26 180 top
D9  90.93,68.33 180 top
D10  91.44,60.2 180 top
FB1  3.12,63.26 90 top
FB2  4.76,63.23 90 top
FB3  48.01,67.56 270 top
FB4  66.55,71.37 270 top
IC1  5.33,17.53 90 top
IC2  7.37,39.12 270 top
IC3  9.33,59.67 180 top
IC4  45.21,41.91 0 top
IC5  69.34,40.61 180 top
IC6  98.04,22.61 90 top
IC7  110.49,57.91 270 top
IC8  110.49,62.74 270 top
IC9  110.49,67.56 270 top
IC10  110.49,72.39 270 top
J1  3.56,71.88 0 top
J2  9.91,5.33 0 top
J3  10.67,19.81 270 top
J4  56.9,72.14 0 top
J5  93.98,34.29 0 top
J6  93.98,50.29 180 top
J7  101.09,42.29 180 top
J8  107.19,34.29 0 top
J9  107.19,50.29 180 top
J10  120.9,17.78 90 top
J11  120.9,58.42 90 top
J100  40.64,50.8 0 bottom
LCD100  50.8,38.1 270 bottom
LED1  2.54,51.56 0 top
LED2  4.32,51.56 0 top
LED3  6.1,51.56 0 top
LED4  6.6,14.22 0 top
LED100  72.39,9.53 0 bottom
LED101  72.39,66.67 0 bottom
Q1  34.29,58.42 270 top
R1  2.54,48.77 90 top
R2  2K  [0603-RES]  3.81,14.22 90 top
R3  4.32,48.77 90 top
R4  270R  [0603-RES]  4.57,42.42 0 top
R5  5.84,11.68 0 top
R6  10K  [0603-RES]  5.84,44.2 0 top
R7  6.1,48.77 90 top
R8  10K  [0603-RES]  10.41,38.61 270 top
R9  11.62,63.99 90 top
R10  12.77,59.2 270 top
R11  12.89,63.99 90 top
R12  10K  [0603-RES]  19.81,46.48 0 top
R13  26.67,55.88 270 top
R14  34.04,65.28 270 top
R15  37.34,58.42 180 top
R16  44.45,45.72 270 top
R17  1K  [0603-RES]  45.21,38.61 180 top
R18  52.83,44.45 0 top
R19  2K  [0603-RES]  54.36,66.04 0 top
R20  56.39,44.45 180 top
R21  1K  [0603-RES]  56.64,66.8 90 top
R22  60.96,39.88 90 top
R23  60.96,43.18 270 top
R24  61.47,67.31 90 top
R25  62.74,42.67 90 top
R26  63.25,39.37 0 top
R27  64.01,42.67 90 top
R28  74.42,36.83 90 top
R29  76.19,65.86 270 top
R30  76.61,9.49 0 top
R31  80.62,58.34 90 top
R32  80.77,28.02 270 top
R33  81.2,15.54 0 top
R34  81.46,45.16 0 top
R35  87.38,25.4 90 top
R36  87.38,28.7 270 top
R37  87.63,33.02 90 top
R38  88.14,16 90 top
R39  88.14,19.3 270 top
R40  90.94,29.49 90 top
R41  97.28,54.61 270 top
R42  99.31,54.61 270 top
R43  100.18,30.13 0 top
R44  101.09,54.61 270 top
R45  103.38,54.61 270 top
R46  103.98,29.53 90 top
R47  104.65,57.15 180 top
R48  104.65,61.98 180 top
R49  104.65,66.8 180 top
R50  104.65,71.63 180 top
R51  111.76,3.68 180 top
R52  111.76,6.99 0 top
R53  111.76,10.29 180 top
R54  111.76,13.59 0 top
R55  111.76,16.89 180 top
R56  111.76,20.19 0 top
R57  111.76,24.03 180 top
R58  111.76,27.3 0 top
SJ1  33.1,55.6 180 top
SJ2  46.77,59.57 270 top
SJ3  49.31,59.52 270 top
SJ4  51.85,59.42 270 top
SJ5  54.39,59.46 270 top
SJ6  56.9,59.44 270 top
SW100  81.92,19.05 0 bottom
SW101  81.92,31.75 0 bottom
SW102  81.92,44.45 0 bottom
SW103  81.92,57.15 0 bottom
TP1  27.18,9.91 90 top
TP2  32.26,9.91 90 top
TP3  37.34,9.91 90 top
TP4  42.42,9.91 90 top
TP5  47.5,9.91 90 top
TP6  80.52,72.14 90 top

### Tracks (layer width: path | path; a pad name or v marks a point on that pad's centre or on a via)
3V3
  Top 0.61: R16.1 J100.17
  Bottom 0.61: J100.17 44.45,48.01 45.21,47.24 63.75,47.24 64.77,48.26 J100.1 65.02,49.53
5V_RFID_TX
  Top 0.305: R21.2 56.64,68.58 58.17,70.1 J4.3
!BUTTON0
  Top 0.305: R31.1 80.64,57.56 SW103.3 80.64,54.23 71.37,44.96 70.61,44.96 69.85,44.2 IC5.13
!BUTTON1  (via drill 0.3)
  Top 0.305: IC5.14 70.61,43.54 v70.67,43.6 | R34.1 80.64,45.1 SW102.3
  Bottom 0.305: v70.67,43.6 80.22,43.6 SW102.3
!BUTTON2  (via drill 0.3)
  Top 0.305: IC5.15 69.88,42.9 v70.1,42.67 | R32.1 80.77,30.36 SW101.3
  Bottom 0.305: v70.1,42.67 78.74,42.67 81.79,39.62 81.79,31.5 80.77,30.48 SW101.3
!BUTTON3  (via drill 0.3)
  Top 0.305: v80.6,25.18 80.6,17.82 | 80.6,17.82 SW100.3 | IC5.16 69.01,42.24 v69.34,41.91 | 80.6,17.82 80.6,15.69 R33.1
  Bottom 0.305: v69.34,41.91 78.49,41.91 81.03,39.37 81.03,33.27 78.99,31.24 78.99,26.79 v80.6,25.18
!I/O_IRQ  (via drill 0.3)
  Top 0.305: IC5.1 71.32,37.03 70.36,36.07 v70.36,34.54 | J100.11 52.07,44.46 R18.1 v52.08,43.18
  Bottom 0.305: v70.36,34.54 69.6,33.78 61.72,33.78 52.32,43.18 v52.08,43.18
!I/O_RESET  (via drill 0.3)
  Top 0.305: IC5.3 70.84,38.33 69.34,36.83 v69.34,35.56 | J100.7 57.15,44.46 R20.1 57.15,44.44 v57.15,43.18
  Bottom 0.305: v69.34,35.56 68.33,34.54 62.23,34.54 57.15,39.62 v57.15,43.18
!PWR_LOSS
  Top 0.305: IC2.1 8.33,44.65 10.16,46.48 R12.1 19.05,46.49 J100.37
+3.3V  (via drill 0.3, 0.4, 0.6)
  Top 0.305: R27.2 63.4,43.42 R25.2 | v81.79,58.93 81.62,59.09 R31.2 | R39.2 v88.14,17.53 | R35.2 v87.38,26.92 R36.2 | R34.2 82.86,45.16 v83.06,44.96 | R18.2 v54.61,44.45 R20.2 | IC5.24 66.24,37.03 66.04,36.83 66.04,35.85 C14.1 | 20.57,46.49 R12.2 | D1.2 59.93,67.8 v59.94,67.82 | D2.2 67.12,67.5 67.43,67.19 C16.1
  Top 0.406: v82.04,27.18 81.95,27.27 R32.2 | R33.2 82.85,15.54 v83.06,15.75 83.06,14.73 77.82,9.49 R30.2 | R38.2 v88.14,17.53 | R7.1 6.1,47.24 v6.35,46.99 | v20.57,47.5 20.57,46.49 | R29.2 76.19,64.02 76.2,64.01 | TP4.1 42.42,30.99 48.01,36.58 v48.01,45.97
  Top 0.61: IC4.5 44.26,44.26 44.45,44.45 | 44.45,44.45 R16.2 | 44.45,44.45 44.7,44.7 45.72,44.7 46.99,45.97 v48.01,45.97 | v75.18,64.01 76.2,64.01 78.49,64.01 81.79,60.71 v81.79,58.93 | R22.2 v60.96,41.55 R23.2 | 63.4,43.42 63.4,44.35 v63.75,44.7 | C13.1 66.18,35.71 | 66.18,35.71 C14.1 | 66.18,35.71 66.96,35.71 v67.06,35.81 | R13.1 26.67,61.98 31.42,66.73 R14.1 34.11,66.8 35.81,66.8 38.61,64.01 48.01,64.01 | R12.2 20.56,45.22 23.62,42.16 41.91,42.16 42.71,42.96 C9.1 | v49.53,64.01 48.01,64.01 | FB3.2 48.01,64.01 | LCD100.2 67.11,63.85 C15.1 67.53,65.94 C16.1
  Top 0.813: C9.1 43.94,43.94 44.26,44.26
  Bottom 0.305: 87.88,26.92 88.01,27.05 88.14,26.92 | v83.06,44.96 83.82,44.96 83.95,45.09 | v82.04,27.18 82.3,27.18 | 60.96,45.72 61.21,45.97 | v54.61,44.45 54.61,45.97 | v59.94,67.82 59.94,64.01 | 64.77,64.26 64.52,64.01
  Bottom 0.406: 90.93,38.1 89.66,36.83 89.66,28.7 88.01,27.05 | 87.88,26.92 v87.38,26.92 86.87,26.42 83.06,26.42 82.3,27.18 | 88.14,26.92 v88.14,17.53 84.84,17.53 v83.06,15.75 | v6.35,46.99 20.07,46.99 v20.57,47.5
  Bottom 0.61: J7.8 102.36,39.37 101.09,38.1 90.93,38.1 83.95,45.09 82.55,46.48 | v81.79,58.93 82.8,57.91 82.8,46.74 82.55,46.48 | 82.55,46.48 81.03,46.48 79.5,48.01 76.71,48.01 75.18,46.48 69.09,46.48 68.58,45.97 64.01,45.97 | v48.01,45.97 54.61,45.97 61.21,45.97 64.01,45.97 | 60.96,45.72 v60.96,41.55 60.96,37.59 62.74,35.81 v67.06,35.81 | v49.53,64.01 59.94,64.01 64.52,64.01 66.29,64.01 67.11,63.19 LCD100.2 67.11,63.05 68.07,64.01 v75.18,64.01 | v63.75,44.7 63.75,45.72 64.01,45.97
+5VB  (via drill 0.3, 0.4, 0.6)
  Top 0.305: D8.2 89.17,65.26 v89.15,65.28 | D10.2 89.68,61.2 v89.66,61.21 | D5.2 91.88,16.72 v91.9,16.7 | v91.9,12.29 91.9,13.21 D4.2 | D6.2 91.88,20.52 v91.9,20.5 | D7.2 91.88,24.32 v91.9,24.3 | v89.15,69.34 89.97,69.34 D9.2 | v92.2,55.12 91.14,55.12 D3.2 | R3.1 4.32,46.99 5.33,45.97 7.37,45.97 7.62,45.72 7.7,45.72 | 66.32,70.29 FB4.2 | 67.63,69.53 v67.82,69.34 | v96.01,39.37 96.01,31.24 94.74,29.97 v92.96,29.97
  Top 0.406: R17.2 44.45,39.12 44.26,39.3 IC4.1 43.91,40.61 43.47,40.17 C10.1 | IC2.7 7.7,37.67 7.87,37.85 | 7.87,37.85 7.7,38.02 IC2.2 7.7,45.72 | v9.91,66.29 9.91,64.78 C7.1 | 7.87,37.85 10.4,37.85 R8.2 | 11.6,64.75 R9.2 | TP3.1 37.34,37.59 37.6,37.86
  Top 0.61: 11.6,64.75 C7.1 | J100.4 J100.2 | 7.7,45.72 7.7,54.18 v7.87,54.36 | R8.2 37.6,37.86 39.92,40.17 C10.1 | R9.2 R11.2 | FB4.2 66.55,69.85 67.06,69.34 v67.82,69.34
  Bottom 0.305: v91.9,12.29 v91.9,16.7 v91.9,20.5 v91.9,24.3 91.95,24.35 91.95,29.46 92.46,29.97 v92.96,29.97 | v89.15,69.34 v89.15,65.28 89.66,64.77 v89.66,61.21 92.98,57.9 92.98,55.9 v92.2,55.12 91.97,54.89 91.97,46.71 92.71,45.97 95.25,45.97 96.01,45.21 v96.01,39.37
  Bottom 0.406: v7.87,54.36 7.87,64.26 v9.91,66.29
  Bottom 0.61: v7.87,54.36 8.03,54.51 61.72,54.51 62.23,54 J100.4 J100.2 69.34,56.64 73.15,56.64 77.09,60.58 | 77.09,60.58 81.79,65.28 v89.15,65.28 | 77.09,60.58 77.09,67.44 75.18,69.34 v67.82,69.34
  pour Top (no thermals): 8.38,60.76 8.38,61.72 8.64,61.98 8.89,61.98 9.4,62.48 9.4,65.28 10.67,65.28 10.67,62.48 10.03,62.48 9.22,61.67 9.22,60.76
+5VIN  (via drill 0.3, 0.8)
  Top 0.305: R1.1 2.54,29.97 3.05,29.46 v3.05,29.21 | R5.1 v4.32,11.68
  Top 0.406: IC2.6 7.04,34.94 C3.1 | TP1.1 27.18,6.86 26.42,6.1 11.94,6.1 J2.2
  Top 0.61: C2.1 4.06,18.51 IC1.4
  Top 0.813: C3.1 6.35,34.25 6.35,32.51 v3.05,29.21 | v1.52,19.81 4.03,19.81 C2.1
  Bottom 0.305: v4.32,11.68 2.54,11.68
  Bottom 0.813: J7.4 107.44,38.1 | 107.44,38.1 107.44,36.58 | J8.3 108.19,35.83 107.44,36.58 | 107.44,36.58 96.01,36.58 94.98,35.54 J5.3 94.98,29.45 94.23,28.7 94.23,14.73 93.73,14.22 93.73,10.41 85.6,2.29 42.42,2.29 | J6.3 92.98,49.51 94.23,48.26 106.17,48.26 | 106.17,48.26 111,48.26 112.27,46.99 112.27,39.12 111.25,38.1 107.44,38.1 | J9.3 106.17,50.28 106.17,48.26 | 42.42,2.29 11.68,2.29 | 11.68,2.29 6.86,2.29 2.54,6.6 2.54,11.68 2.54,19.81 | 42.29,2.41 42.42,2.29 | 2.54,19.81 2.54,28.7 v3.05,29.21 | v1.52,19.81 2.54,19.81 | J2.2 11.81,2.41 11.68,2.29
CHARGE_STATUS  (via drill 0.3)
  Top 0.305: LED4.C 6.63,15 IC1.1 12.51,16.58 24.38,28.45 v24.38,35.31 | J100.32 25.4,50.8 25.4,47.24 24.38,46.23 v24.38,43.94
  Top 0.406: J100.32 R13.2
  Bottom 0.305: v24.38,35.31 v24.38,43.94
GND  (via drill 0.3, 0.4)
  Top 0.305: v9.33,59.42 IC3.11 6.87,59.42 6.86,59.44 | v9.33,59.42 IC3.THERMAL 9.58,59.92 IC3.3 11.48,59.92 | IC3.15 9.58,59.17 v9.33,59.42
  Top 0.61: 69.6,62 LCD100.1 69.65,63.74 C15.2 69.13,65.94 C16.2
  Bottom 0.305: v9.33,59.42 9.4,59.42 9.4,59.69
  other vias: 6.6,22.61 4.83,13.46 42.67,37.34 45.21,41.91 72.9,45.21 96.52,26.92 96.44,25.02 96.44,21.97 96.44,19.43 89.66,26.42 89.66,22.61 89.66,18.8 88.39,64.26
  pour Top (rank 2): 2.54,76.2 arc90 0,73.66 0,2.54 arc90 2.54,0 124.46,0 arc90 127,2.54 127,73.66 arc90 124.46,76.2
  pour Bottom (rank 2): 0,73.66 0,2.54 arc90 2.54,0 124.46,0 arc90 127,2.54 127,73.66 arc90 124.46,76.2 2.54,76.2 arc90
I2C_SCL  (via drill 0.3)
  Top 0.305: J100.5 59.69,39.62 60.2,39.12 60.95,39.12 R22.1 60.96,38.86 61.49,38.33 IC5.22 67.79,38.33 v69.6,40.13 | v78.74,40.13 81.03,40.13 84.45,43.56 J7.15
  Bottom 0.305: v69.6,40.13 v78.74,40.13
I2C_SDA  (via drill 0.3)
  Top 0.305: J100.3 v62.23,44.96 61.47,44.96 60.96,44.45 R23.1 | v64.52,37.34 64.87,37.69 IC5.23 68.68,37.69 v69.6,38.61 | v80.01,38.61 81.28,38.61 84.96,42.29 93.85,42.29 94.74,43.18 J7.13
  Bottom 0.305: v62.23,44.96 62.23,38.35 63.25,37.34 v64.52,37.34 | v69.6,38.61 v80.01,38.61
I2S_BCK  (via drill 0.3)
  Top 0.305: IC3.16 10.08,57.48 v14.22,53.34
  Bottom 0.305: J100.12 52.07,51.82 51.05,50.8 15.75,50.8 14.22,52.32 v14.22,53.34
I2S_DOUT
  Top 0.305: IC3.1 10.83,58.51 16.51,52.83 J100.40
I2S_WS/LRCLK
  Top 0.305: J100.35 20.32,50.8 15.75,50.8 9.08,57.47 IC3.14
IN0  (via drill 0.3)
  Top 0.305: IC5.4 74.8,38.99 v83.06,30.73 83.06,20.07 87.88,15.24 88.13,15.24 R38.1 90.9,15.25 D4.3 90.95,15.24 93.47,15.24 94.89,16.66 IC6.16 | R37.1 87.63,31.43 v87.6,31.4
  Bottom 0.305: v87.6,31.4 86.93,30.73 v83.06,30.73
IN0P
  Top 0.305: R37.2 88.15,34.29 J5.1 91,34.31 91,36.1 92.2,37.3 J7.16
IN1  (via drill 0.3)
  Top 0.305: IC5.5 75.67,39.65 84.07,31.24 84.07,30.23 83.82,29.97 v83.82,29.61 83.82,22.35 86.11,20.07 88.15,20.07 | IC6.14 93.85,20.7 92.71,19.56 90.95,19.56 | 90.95,19.56 D5.3 | 90.95,19.56 89.92,19.56 89.41,20.07 88.15,20.07 | 88.15,20.07 R39.1 | 89.12,29.5 v88.9,29.72 89.88,28.74 R40.1
  Bottom 0.305: v83.82,29.61 87.01,29.61 87.12,29.72 v88.9,29.72
IN1P
  Top 0.305: R40.2 90.94,31.34 92.98,33.38 J5.2 93,34.31 93,36 94.74,37.74 J7.14
IN2  (via drill 0.3)
  Top 0.305: IC5.6 76.05,40.28 85.09,31.24 85.09,29.21 84.58,28.7 84.58,26.42 86.35,24.65 R35.1 88.67,23.35 D6.3 91.04,23.24 IC6.12 96.04,23.24 v96.1,23.3 | R43.1 98.73,30.13 v98.6,30.1
  Bottom 0.305: v98.6,30.1 98.6,25.8 v96.1,23.3
IN2P
  Top 0.305: J7.12 97.28,39.22 100.9,35.6 103.9,35.6 104.19,35.31 J8.1 104.19,32.79 101.6,30.2 101,30.2 R43.2
IN3
  Top 0.305: IC5.7 76.4,40.95 86.36,30.99 86.36,30.23 87.13,29.45 R36.1 87.9,29.45 90.19,27.16 D7.3 92.47,27.16 | 92.47,27.16 93.85,25.78 IC6.10 | R46.1 94.09,28.78 92.47,27.16
IN3P
  Top 0.305: R46.2 104,30.3 104,30.9 106.19,33.09 J8.2 106.19,35.21 104.8,36.6 102.4,36.6 99.82,39.18 J7.10
LCD_BACKLIGHT
  Top 0.305: J100.29 29.46,49.53 30.48,50.55 30.48,54.86 31.24,55.63 32.31,55.63 SJ1.2
LCD_CS
  Top 0.305: SJ2.2 46.77,57.43 45.97,56.64 39.88,56.64 36.83,53.59 J100.24
LCD_D/C
  Top 0.305: SJ5.2 54.39,57.18 51.56,54.36 46.74,54.36 J100.18
LCD_MOSI
  Top 0.305: SJ4.2 51.85,55.91 51.05,55.12 42.16,55.12 40.64,53.59 40.64,50.8 J100.19
LCD_RESET
  Top 0.305: SJ6.2 56.9,57.66 52.83,53.59 47.5,53.59 46.99,53.09 J100.16
LCD_SCK
  Top 0.305: 49.31,58.45 SJ3.2 49.28,58.73 49.28,57.66 47.5,55.88 40.39,55.88 38.1,53.59 38.1,50.8 J100.23
LED0
  Top 0.305: IC5.17 65.35,41.58 65.02,41.91 65.02,44.7 66.55,46.23 71.63,46.23 73.03,47.62
  Top 0.406: LED101.K 71.12,64.26 73.15,62.23 73.15,47.75 73.03,47.62
LED1  (via drill 0.4)
  Top 0.406: IC5.18 67.87,40.95 v68.07,41.15 | v73.66,32.51 73.66,12.06 LED100.K
  Bottom 0.406: v68.07,41.15 68.07,38.1 v73.66,32.51
N$1
  Top 0.305: IC3.2 11.67,59.42 12.19,59.94 R10.1 12.77,62.04 12.89,62.16 R11.1
N$2
  Top 0.305: IC3.9 5.36,60.42 4.76,61.03 FB2.1
N$4
  Top 0.305: FB1.1 3.12,60.64 3.83,59.92 IC3.10
N$5
  Top 0.305: R9.1 11.62,60.64 11.4,60.42 IC3.4
N$6
  Top 0.61: C1.1 1.54,64.11 FB1.2 3.12,71.44 J1.1
N$7
  Top 0.61: C4.1 4.77,64.06 FB2.2 4.76,69.27 6.1,70.61 J1.2
N$8
  Top 0.305: IC5.20 65.25,39.65 64.77,40.13 63.5,40.13 62.74,40.89 R25.1
N$9
  Top 0.61: LCD100.15 34.09,63.77 R14.2
N$10
  Top 0.305: J4.4 60.71,70.87 61.47,70.1 R24.2
N$11
  Top 0.305: R7.2 LED3.A
N$12
  Top 0.305: R3.2 LED2.A
N$13
  Top 0.305: IC5.19 65.38,40.28 64.01,41.66 R27.1
N$14
  Top 0.305: IC1.5 3.82,16.36
  Top 0.406: 3.82,16.36 3.82,14.99 R2.2
N$15
  Top 0.61: R52.1 108.08,6.99 104.65,10.41 104.65,16.76 101.98,19.43 IC6.2
N$16
  cutout Top: 110.49,76.2 110.49,52.58 113.79,49.28 113.79,34.04 107.7,27.94 100.58,27.94 99.31,26.67 99.31,0 124.46,0 arc90 127,2.54 127,73.66 arc90 124.46,76.2
  cutout Bottom: 110.49,76.2 110.49,52.58 113.79,49.28 113.79,34.04 107.7,27.94 100.58,27.94 99.31,26.67 99.31,0 124.46,0 arc90 127,2.54 127,73.66 arc90 124.46,76.2
N$17
  Top 0.305: LED4.A 6.6,11.7 R5.2
N$18
  Top 0.406: IC4.3 46.16,39.3 45.97,39.12 45.97,38.62 R17.1
N$19
  Top 0.61: IC6.1 101.19,16.92 103.38,14.73 103.38,9.91 108.71,4.57 108.71,4.03 R51.2
N$20
  Top 0.61: R58.1 108.08,27.3 107.82,27.05 IC6.8
N$21
  Top 0.305: IC5.21 64.9,38.99 64.52,39.37 R26.2
N$22
  Top 0.305: IC5.2 74.41,37.69 R28.2
N$23
  Top 0.61: IC6.7 106.05,25.78 107.8,24.03 R57.2
N$24
  Top 0.61: IC6.6 104.27,24.51 108.58,20.19 R56.1
N$25
  Top 0.61: IC6.5 103.5,23.24 108.71,18.03 108.71,17.24 R55.2
N$27
  Top 0.305: LCD100.6 56.95,60.25 SJ6.1
N$28
  Top 0.305: LCD100.7 54.39,61.95 SJ5.1
N$29
  Top 0.305: SJ2.1 46.79,60.33 LCD100.10
N$30
  Top 0.305: SJ4.1 51.87,60.18 LCD100.8
N$31
  Top 0.305: SJ3.1 49.33,60.29 LCD100.9
N$32
  Top 0.61: IC7.3 113.28,52.58 115.32,50.55 115.32,48.77 119,45.09 J11.1
N$33
  Top 0.305: SJ1.1 34.77,55.6 35.31,56.13 35.31,58.4 Q1.3 R15.2
N$34
  Top 0.61: LCD100.16 31.55,61.92 33.27,60.2 33.27,59.39 Q1.1
N$36
  Top 0.61: IC6.4 103,21.97 107.19,17.78 107.19,14.48 108.08,13.59 R54.1
N$37
  Top 0.305: IC2.4 6.4,42.37 6.35,42.42 R4.2
N$39
  Top 0.61: IC6.3 102.49,20.7 105.92,17.27 105.92,13.72 108.71,10.92 108.71,10.63 R53.2
N$40
  Top 0.61: R54.2 117.98,13.59 J10.4
N$41
  Top 0.61: R53.1 118.49,10.29 J10.3
N$42
  Top 0.61: R52.2 119,6.99 J10.2
N$43
  Top 0.61: R51.1 119.51,3.68 J10.1
N$44
  Top 0.61: R55.1 117.47,16.89 J10.5
N$45
  Top 0.61: R56.2 116.97,20.19 J10.6
N$46
  Top 0.61: R57.1 116.99,24.03 J10.7
N$47
  Top 0.61: R58.2 116.46,27.3 J10.8
N$48
  Top 0.406: LED101.A 76.12,66.67 R29.1
N$49
  Top 0.406: R30.1 73.69,9.49 LED100.A
N$50
  Top 0.305: R1.2 LED1.A
N$51
  Top 0.61: 55.63,74.17 56.13,74.68 63.5,74.68 65.95,72.22 FB4.1 | 55.63,74.17 J4.2 | 55.63,74.17 55.12,74.68 49.53,74.68 47.92,73.06 C11.1 47.87,72.19 C12.1 48.01,70.22 FB3.1
N$58
  Top 0.305: IC7.1 107.43,59.18 R47.1
N$59
  Top 0.61: J11.2 118.75,48.9 114.81,52.83 114.81,58.42 114.05,59.18 IC7.4
N$60
  Top 0.61: J11.7 117.47,67.94 114.3,71.12 IC10.3
N$61
  Top 0.305: IC8.1 107.43,64.01 R48.1
N$62
  Top 0.61: J11.8 116.2,71.75 114.3,73.66 IC10.4
N$63
  Top 0.61: IC9.3 114.3,66.29 J11.5
N$64
  Top 0.61: J11.6 119,64.14 114.3,68.83 IC9.4
N$65
  Top 0.61: J11.3 116.08,56.9 116.08,59.44 114.05,61.47 IC8.3
N$66
  Top 0.61: J11.4 117.35,59.44 117.35,60.96 114.3,64.01 IC8.4
N$68
  Top 0.305: IC9.1 107.43,68.83 R49.1
N$69
  Top 0.305: IC10.1 107.43,73.66 R50.1
OUT0
  Top 0.305: IC5.8 74.35,41.58 76.2,43.43 76.2,45.72 87.63,57.15 90.15,57.15 D3.3 103.38,57.13 | 103.38,57.13 103.88,57.13 R47.2 | R45.1 103.38,57.13
OUT0P
  Top 0.305: R45.2 107.74,53.86 110.2,51.4 110.2,50.3 J9.1 110.19,43.77 J7.1
OUT1  (via drill 0.3)
  Top 0.305: IC5.9 73.99,42.24 75.44,43.69 75.44,45.97 88.65,59.18 91.44,59.18 | 91.44,59.18 v100.33,59.18 103.12,61.98 R48.2 | D10.3 91.44,59.18 | R44.1 v101.09,56.13
  Bottom 0.305: v101.09,56.13 101.09,58.42 v100.33,59.18
OUT1P
  Top 0.305: R44.2 101.09,53.09 101.6,52.58 107.12,52.58 108.2,51.5 108.2,50.3 J9.2 108.19,45.89 107.5,45.2 107.5,43.62 J7.3
OUT2  (via drill 0.3)
  Top 0.305: IC5.10 73.64,42.9 74.68,43.94 74.68,46.23 88.14,59.69 88.14,60.96 90.44,63.26 D8.3 92.47,63.26 | R49.2 102.87,66.8 101.85,67.82 95.5,67.82 93.22,65.53 93.22,64.01 92.47,63.26 | v92.46,63.25 92.47,63.26 | R42.1 v99.31,56.13
  Bottom 0.305: v92.46,63.25 92.46,62.74 99.06,56.13 v99.31,56.13
OUT2P
  Top 0.305: R42.2 99.31,52.63 J6.1 97,50.27 97,49 97.8,48.2 104,48.2 104.9,47.3 J7.5
OUT3  (via drill 0.3)
  Top 0.305: IC5.11 73.25,43.54 73.91,44.2 73.91,46.48 87.38,59.94 87.38,65.02 89.66,67.31 90.92,67.31 D9.3 | D9.3 92.98,67.33 97.28,71.63 103.63,71.63 R50.2 | R41.1 v97.28,56.13 | v90.93,66.29 D9.3
  Bottom 0.305: v90.93,66.29 91.19,66.04 91.19,62.23 v97.28,56.13
OUT3P
  Top 0.305: R41.2 97.16,53.86 95,51.7 95,50.31 | 95,50.31 J6.2 | 95,50.31 95,49.3 97.1,47.2 101,47.2 102.4,45.8 102.4,43.6 J7.7
RFID_RX  (via drill 0.3)
  Top 0.305: J7.11 97.28,44.7 96.52,45.47 84.84,45.47 v81.79,48.51 | 61.73,66.55 R24.1 | R24.1 61.72,66.55 | R24.1 61.47,65.02 60.76,64.31 60.76,58.98 57.15,55.37 J100.8 58.67,53.59 v70.61,53.59 | D2.3 63,66.56 R24.1
  Bottom 0.305: v81.79,48.51 76.71,53.59 v70.61,53.59
RFID_TX  (via drill 0.3)
  Top 0.305: J7.9 99.82,45.21 98.55,46.48 85.09,46.48 v81.79,49.78 | J100.10 54.61,54.1 58.22,57.71 58.22,65.23 57.93,65.52 D1.3 57.91,66.06 R21.1 55.12,66.05 R19.2
  Bottom 0.305: v81.79,49.78 77.72,53.85 77.47,54.1 77.22,54.36 69.6,54.36 66.04,50.8 55.88,50.8 J100.10
SHUTDOWN  (via drill 0.3)
  Top 0.305: IC2.3 7.04,44.13 6.97,44.2 R6.2 v6.59,45.2 v6.6,45.21 | J100.13 48.26,50.8 43.69,50.8 43.18,50.29 43.18,48.26 v41.4,46.48
  Bottom 0.305: v41.4,46.48 40.13,45.21 v6.6,45.21
V_BATT  (via drill 0.4)
  Top 0.406: IC2.8 8.33,34.81 C8.1 | v17.02,5.08 30.99,5.08 32.26,6.35 TP2.1
  Top 0.61: C5.1 6.63,19.74 6.63,19.05 IC1.3
  Top 0.813: C8.1 8.89,34.25 8.89,19.32 9.4,18.81 | J3.2 9.4,18.81 | 9.4,18.81 6.87,18.81 6.63,19.05
  Bottom 0.406: J3.2 10.67,11.43 v17.02,5.08
(copper drawn outside any net)
  shapes: Bottom circle x4, Top area x2944

### Text on the board
tPlace: - | + | RFID | - + | GND | SPEAKER | - + | - + | +5VIN | +5VB | +3.3 | DRY OUTPUTS: 60V 0.7A MAX | - + | 1S LIPO | CHARGING | INPUTS: 5-24V AC/DC | + | GND | +5VIN | BATT | +5VB | +3.3V | Ver 1.0 | A. Shrey | https://github.com/makeitlabs/ratt/ | 2/26/2018 | +5V POWER IN